# Altium schematic sheet Course.SchDoc
size 594 x 420 mm; Author: ALTIUM GOSTBOM2.0 KEV; SheetNumber: 2; SheetTotal: 2
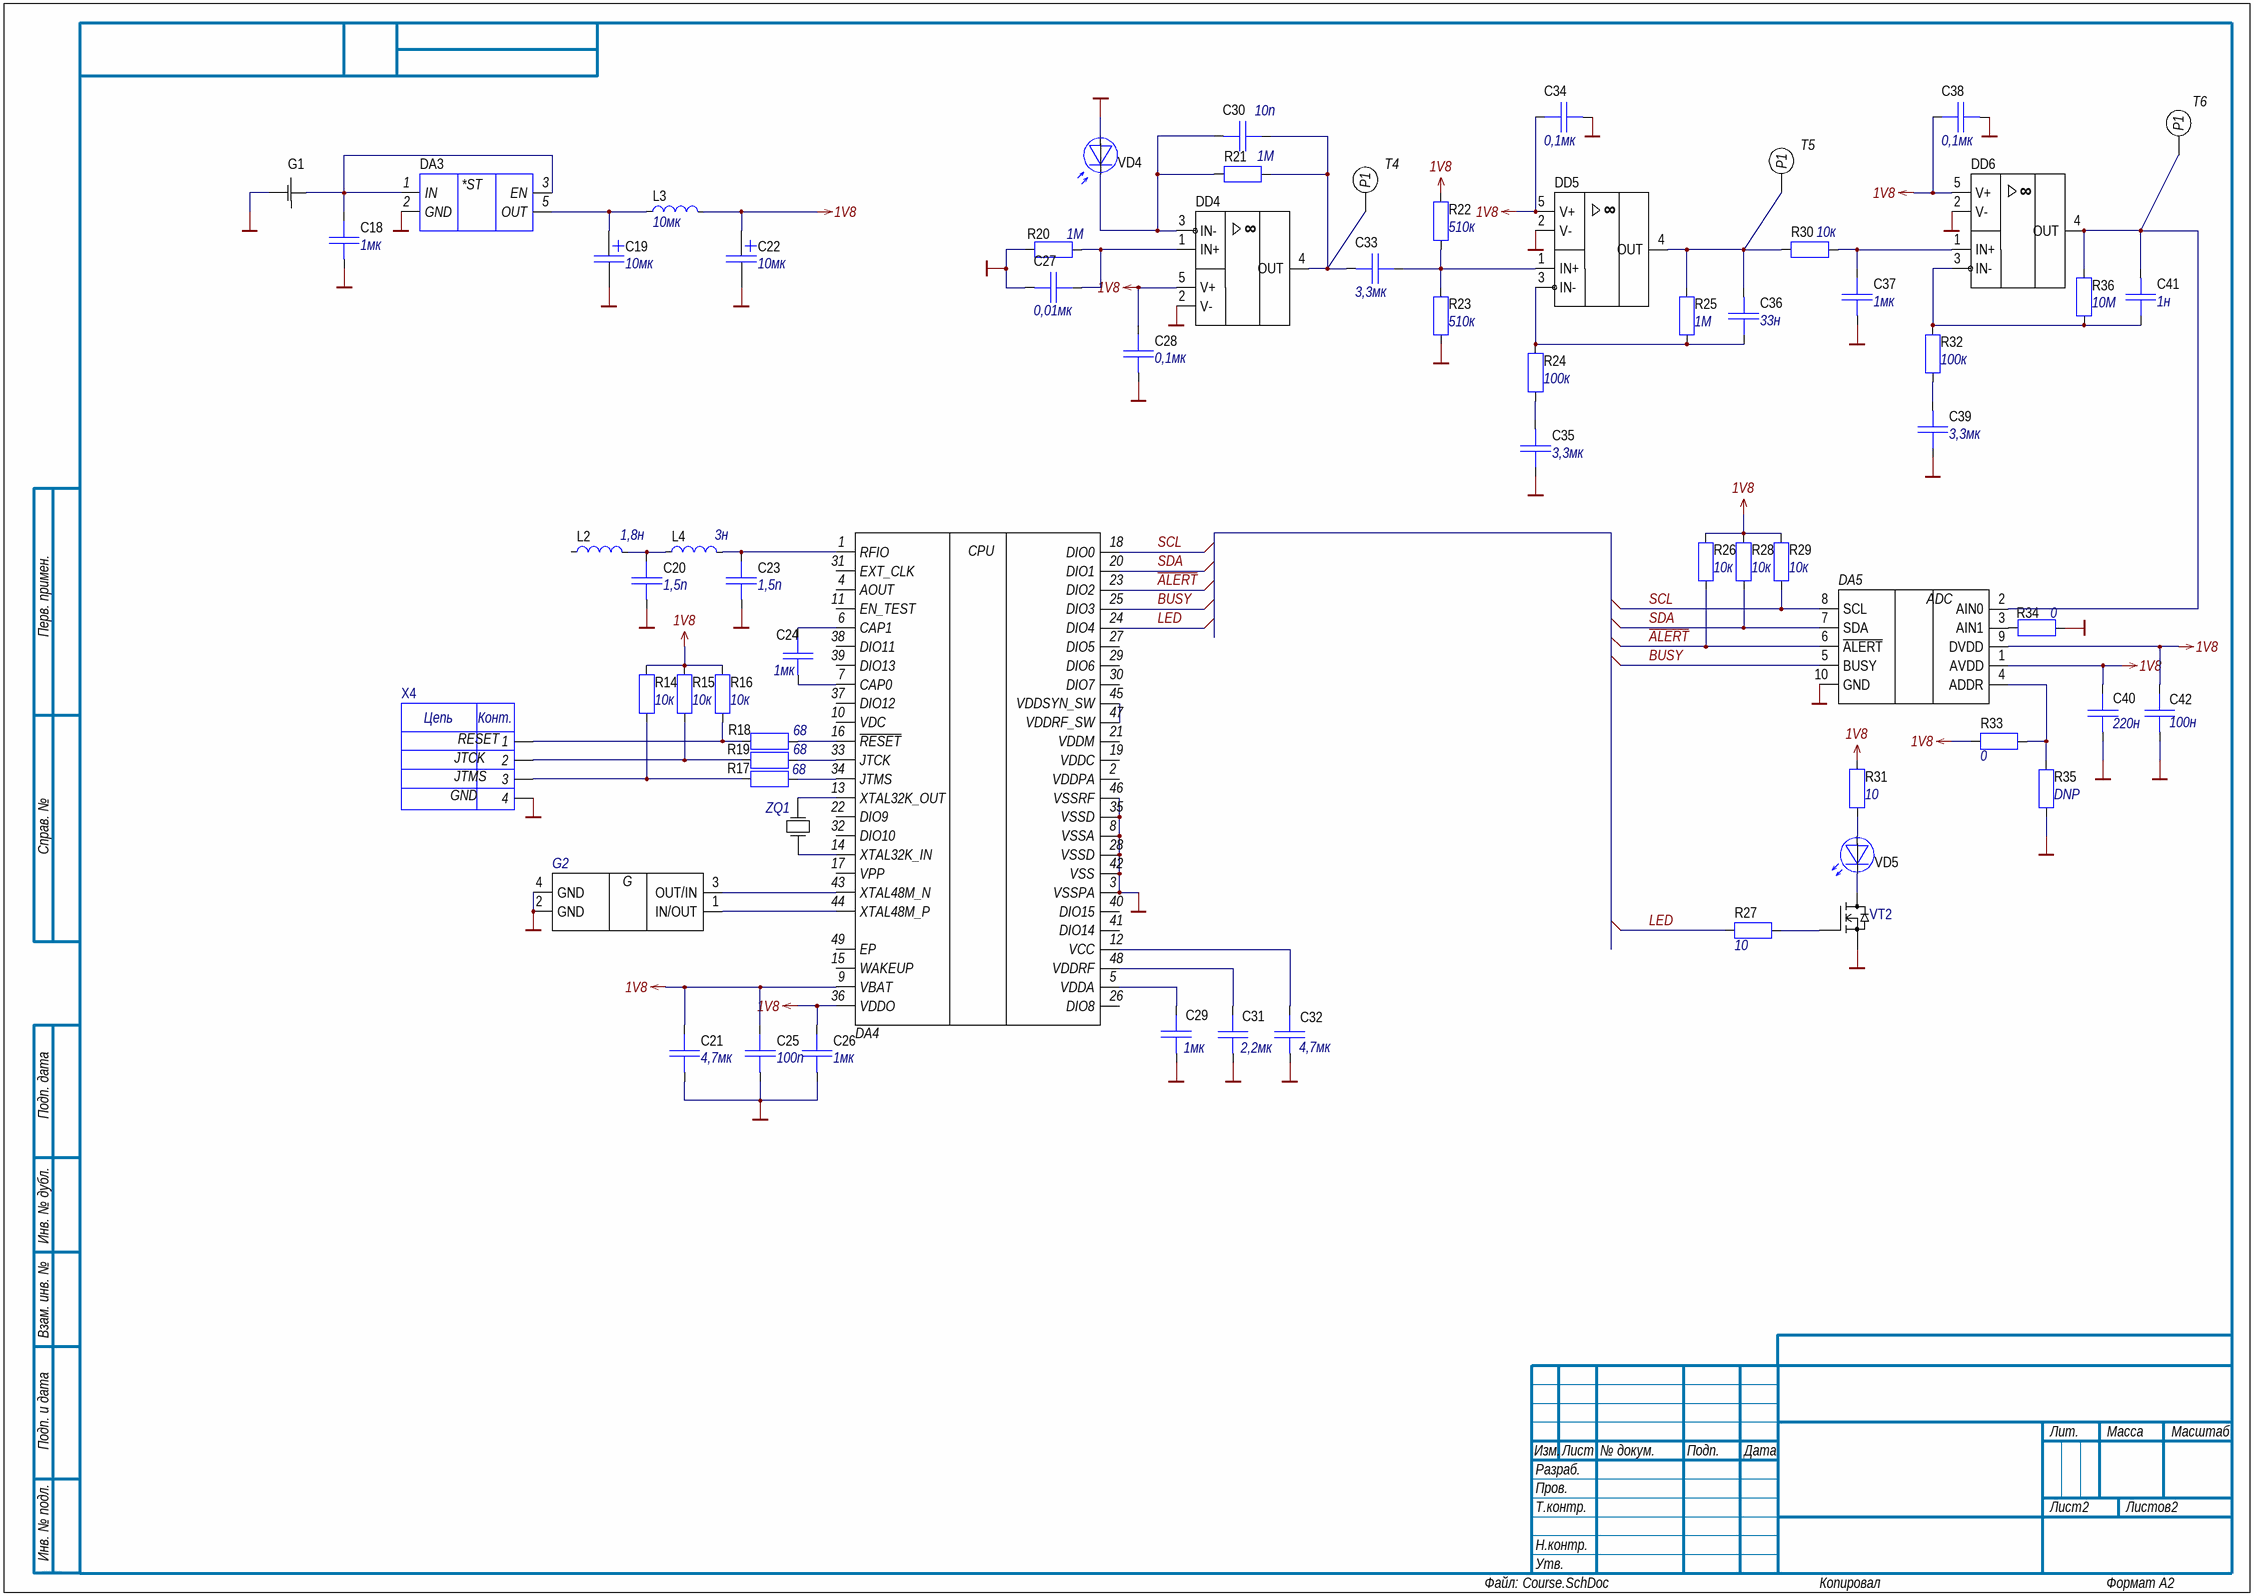
[diagram p0: Course.SchDoc]

## Parts
C18  1мк  [cap0603]
C19  10мк
C20  1,5п  [cap0603]
C21  4,7мк  [CAP0805]
C22  10мк
C23  1,5п  [cap0603]
C24  1мк  [cap0603]
C25  100п  [cap0603]
C26  1мк  [cap0603]
C27  0,01мк  [cap0603]
C28  0,1мк  [cap0603]
C29  1мк  [cap0603]
C30  10п  [cap0603]
C31  2,2мк  [cap0603]
C32  4,7мк  [CAP0805]
C33  3,3мк  [CAP0805]
C34  0,1мк  [cap0603]
C35  3,3мк  [CAP0805]
C36  33н  [cap0603]
C37  1мк  [cap0603]
C38  0,1мк  [cap0603]
C39  3,3мк  [CAP0805]
C40  220н  [cap0603]
C41  1н  [cap0603]
C42  100н  [cap0603]
DA3  (no value)  [TPS7A02]
DA4  RSL10  [RSL10]  (value not drawn)
DA5  ADC  [ADS7142IRUGT]  (value not drawn)
DD4  operational amplifier_2  [OPA333]  (value not drawn)
DD5  operational amplifier_1  [OPA333]  (value not drawn)
DD6  operational amplifier_1  [OPA333]  (value not drawn)
G1  battery  (value not drawn)
G2  Обозначение при заказе  [XTAL48]  (value not drawn)
L2  1,8н  [IND0402]
L3  10мк  [MLZ1608M100WT000]
L4  3н  [IND0402]
R14  10к  [Res0603]
R15  10к  [Res0603]
R16  10к  [Res0603]
R17  68  [Res0603]
R18  68  [Res0603]
R19  68  [Res0603]
R20  1M  [Res0603]
R21  1M  [Res0603]
R22  510к  [Res0603]
R23  510к  [Res0603]
R24  100к  [Res0603]
R25  1М  [Res0603]
R26  10к  [Res0603]
R27  10  [Res0603]
R28  10к  [Res0603]
R29  10к  [Res0603]
R30  10к  [Res0603]
R31  10  [Res0603]
R32  100к  [Res0603]
R33  0  [Res0603]
R34  0  [Res0603]
R35  DNP  [Res0603]  (no BOM)
R36  10М  [Res0603]
T4  TestPoint  [TestPoint]  (value not drawn)
T5  TestPoint  [TestPoint]  (value not drawn)
T6  TestPoint  [TestPoint]  (value not drawn)
VD4  (no value)
VD5  (no value)  [LED1206]
VT2  RU1J002YNTCL  [Mosfet]  (value not drawn)
X4  (no value)  [PSL_4]
ZQ1  Обозначение при заказе  [XTAL32]  (value not drawn)

## Nets
1V8: C21.2 C22.1 C25.2 C26.2 C28.2 C34.2 C38.2 C40.2 C42.2 DA4.9(VBAT) DA4.36(VDDO) DA5.1(AVDD) DA5.9(DVDD) DD4.5(V+) DD5.5(V+) DD6.5(V+) L3.2 R14.1 R15.1 R16.1 R22.2 R26.1 R28.1 R29.1 R31.2 R33.1
GND: C18.1 C19.2 C20.1 C21.1 C22.2 C23.1 C25.1 C26.1 C27.1 C28.1 C29.1 C31.1 C32.1 C34.1 C35.2 C37.1 C38.1 C39.2 C40.1 C42.1 DA3.2(GND) DA4.3(VSSPA) DA4.8(VSSA) DA4.28(VSSD) DA4.35(VSSD) DA4.42(VSS) DA4.46(VSSRF) DA5.10(GND) DD4.2(V-) DD5.2(V-) DD6.2(V-) G1.- G2.2(GND) G2.4(GND) R20.1 R23.1 R34.2 R35.2 VD4.1 VT2.2(S) X4.4
~{ALERT}: DA4.23(DIO2) DA5.6(~{ALERT}) R26.2
BUSY: DA4.25(DIO3) DA5.5(BUSY)
LED: DA4.24(DIO4) R27.2
SCL: DA4.18(DIO0) DA5.8(SCL) R29.2
SDA: DA4.20(DIO1) DA5.7(SDA) R28.2
NetC18_2: C18.2 DA3.1(IN) DA3.3(EN) G1.+
NetC19_1: C19.1 DA3.5(OUT) L3.1
NetC20_2: C20.2 L2.2 L4.1
NetC23_2: C23.2 DA4.1(RFIO) L4.2
NetC24_1: C24.1 DA4.7(CAP0)
NetC24_2: C24.2 DA4.6(CAP1)
NetC27_2: C27.2 DD4.1(IN+) R20.2
NetC29_2: C29.2 DA4.5(VDDA)
NetC30_1: C30.1 DD4.3(IN-) R21.1 VD4.2
NetC30_2: C30.2 C33.1 DD4.4(OUT) R21.2 T4.T(P1)
NetC31_2: C31.2 DA4.48(VDDRF)
NetC32_2: C32.2 DA4.12(VCC)
NetC33_2: C33.2 DD5.1(IN+) R22.1 R23.2
NetC35_1: C35.1 R24.2
NetC36_1: C36.1 DD5.4(OUT) R25.1 R30.2 T5.T(P1)
NetC36_2: C36.2 DD5.3(IN-) R24.1 R25.2
NetC37_2: C37.2 DD6.1(IN+) R30.1
NetC39_1: C39.1 R32.2
NetC41_1: C41.1 DA5.2(AIN0) DD6.4(OUT) R36.1 T6.T(P1)
NetC41_2: C41.2 DD6.3(IN-) R32.1 R36.2
NetDA4_13: DA4.13(XTAL32K_OUT) ZQ1.2
NetDA4_14: DA4.14(XTAL32K_IN) ZQ1.1
NetDA4_16: DA4.16(~{RESET}) R18.1
NetDA4_33: DA4.33(JTCK) R19.1
NetDA4_34: DA4.34(JTMS) R17.1
NetDA4_43: DA4.43(XTAL48M_N) G2.3(OUT/IN)
NetDA4_44: DA4.44(XTAL48M_P) G2.1(IN/OUT)
NetDA4_45: DA4.45(VDDSYN_SW) DA4.47(VDDRF_SW)
NetDA5_3: DA5.3(AIN1) R34.1
NetDA5_4: DA5.4(ADDR) R33.2 R35.1
NetR14_2: R14.2 R17.2 X4.3
NetR15_2: R15.2 R19.2 X4.2
NetR16_2: R16.2 R18.2 X4.1
NetR27_1: R27.1 VT2.1(G)
NetR31_1: R31.1 VD5.A
NetVD5_K: VD5.K VT2.3(D)

Not connected (* = marked no-connect by the designer): DA4 2(VDDPA) 4(AOUT) 10(VDC) 11(EN_TEST) 15(WAKEUP) 17(VPP) 19(VDDC) 21(VDDM) 22(DIO9) 26(DIO8) 27(DIO5) 29(DIO6) 30(DIO7) 31(EXT_CLK) 32(DIO10) 37(DIO12) 38(DIO11) 39(DIO13) 40(DIO15) 41(DIO14) 49(EP); L2 1

## Notes on the sheet
- Перв. примен.
- Справ. №
- Подп. дата
- Инв. № дубл.
- Взам. инв. №
- Подп. и дата
- Изм.
- Разраб.
- Лист
- № докум.
- Подп.
- Дата
- Лит.
- Масса
- Масштаб
- Пров.
- Т.контр.
- Листов
- Инв. № подл.
- Н.контр.
- Утв.
- ALTIUM GOSTBOM2.0 KEV
- Файл:
- Копировал
- Формат А2
- (in symbol LDO) *ST
- (in symbol operational amplifier_1) ∞
- (in symbol operational amplifier_2) ∞
- (in symbol PSL4) Цепь; Конт.; RESET; JTCK; JTMS; GND
- (in symbol RSL10) CPU
- (in symbol XTAL48) G

## Library data of the parts
C18 C24 C26 C29 C37 = CapCer: Керамический конденсатор; manufacture: ОЖО.460.107ТУ; nameSuf: -3; name_main: CC0603KRX7R7BB105; Units: Ф; Name: Керамический конденсатор; Value: 1мк
C19 C22 = CapTan: Танталовый конденсатор; manufacture: АЖЯР.673546.004ТУ; name_main: 293D106X9016B2TE3; Units: Ф; Footpr: "E"; Name: Танталовый конденсатор; Value: 10мк
C20 C23 = CapCer: Керамический конденсатор; manufacture: ОЖО.460.107ТУ; name_main: CL10C1R5CB8NNNC; Units: Ф; Name: Керамический конденсатор; Value: 1,5п
C21 C32 C33 C35 C39 = CapCer: Керамический конденсатор; manufacture: ОЖО.460.107ТУ; name_main: GRM21BR60J335K; Units: Ф; Name: Керамический конденсатор
  C21 C32: Value: 4,7мк
  C33 C35 C39: Value: 3,3мк
C25 = CapCer: Керамический конденсатор; manufacture: ОЖО.460.107ТУ; name_main: GRM1885C1H101J; Units: Ф; Name: Керамический конденсатор; Value: 100п
C27 = CapCer: Керамический конденсатор; manufacture: ОЖО.460.107ТУ; name_main: GRM188R71H103K; Units: Ф; Name: Керамический конденсатор; Value: 0,01мк
C28 C34 C38 = CapCer: Керамический конденсатор; manufacture: ОЖО.460.107ТУ; nameSuf: -3; name_main: CC0603KRX7R7BB104; Units: Ф; Name: Керамический конденсатор; Value: 0,1мк
C30 = CapCer: Керамический конденсатор; manufacture: ОЖО.460.107ТУ; name_main: CL10C100JB8NNNC; Units: Ф; Name: Керамический конденсатор; Value: 10п
C31 = CapCer: Керамический конденсатор; manufacture: ОЖО.460.107ТУ; name_main: GRM188R61A225K; Units: Ф; Name: Керамический конденсатор; Value: 2,2мк
C36 = CapCer: Керамический конденсатор; manufacture: ОЖО.460.107ТУ; nameSuf: -3; name_main: CC0603KRX7R7BB333; Units: Ф; Name: Керамический конденсатор; Value: 33н
C40 = CapCer: Керамический конденсатор; manufacture: ОЖО.460.107ТУ; name_main: CL10B224KA8NNNC; Units: Ф; Name: Керамический конденсатор; Value: 220н
C41 = CapCer: Керамический конденсатор; manufacture: ОЖО.460.107ТУ; name_main: GRM188R61C105K; Units: Ф; Name: Керамический конденсатор; Value: 1н
C42 = CapCer: Керамический конденсатор; manufacture: ОЖО.460.107ТУ; name_main: GRM188R71C104KA01D; Units: Ф; Name: Керамический конденсатор; Value: 100н
DA3 = LDO: name: Микросхема; name_main: TPS7A0218PDBVR
DD4 = operational amplifier_2: Операционный усилитель; name_main: OPA333AIDBVR
DD5 DD6 = operational amplifier_1: Операционный усилитель; name_main: OPA333AIDBVR
G2 = XTAL48: ECS-480-8-47-JTN-TR
L2 = Ind: Катушка индуктивности; Units: Гн; name_main: LQG15HS1N8S02D; Name: Катушка индуктивности; Value: 1,8н
L3 = Ind: Катушка индуктивности; Units: Гн; Name: Катушка индуктивности; name_main: MLZ1608M100WT000; Value: 10мк
L4 = Ind: Катушка индуктивности; Units: Гн; name_main: LQG15HS3N0S02D; Name: Катушка индуктивности; Value: 3н
R14-R16 R26 R28-R30 = Res: Резистор; Manufacturer: АЛЯР.434110.005ТУ; Tolerance: 5%; name_main: RC0603FR-0710KL; Name: Резистор; Value: 10к
R17-R19 = Res: Резистор; name_main: AC0603FR-0768RL; Name: Резистор; Value: 68
R20 R25 = Res: Резистор; Tolerance: 1%; name_main: RC0603FR-071ML; Name: Резистор
  R20: Value: 1M
  R25: Value: 1М
R21 = Res: Резистор; name_main: RC0603FR-071ML; Name: Резистор; Value: 1M
R22 R23 = Res: Резистор; name_main: RC0603FR-07510KL; Name: Резистор; Value: 510к
R24 R32 = Res: Резистор; name_main: RC0603FR-07100KL; Name: Резистор; Value: 100к
R27 R31 = Res: Резистор; Tolerance: 5%; name_main: RC0603JR-0710RL; Name: Резистор; Value: 10
R33 R34 = Res: Резистор; Manufacturer: АЛЯР.434110.005ТУ; Tolerance: 5%; name_main: RC0603FR-070RL; Name: Резистор; Value: 0
R35 = Res: Резистор; Manufacturer: АЛЯР.434110.005ТУ; Tolerance: 5%; name_main: Р1-12-0,1-; Name: Резистор; Value: DNP
R36 = Res: Резистор; name_main: RC0603FR-0710ML; Name: Резистор; Value: 10М
VD4 = Photodiode: Name: Детектор; Name_main: SFH 2703
VD5 = Led: Излучатель; manufacture: аА0.339.189ТУ; Name: Индикатор; Name_main: 15412094A9000
VT2 = RU1J002YNTCL: N-MOSFET DirectFET SQ
X4 = PSL4: manufacture: БСАР.430420.014ТУ; name: Разъемы; name_main: PLS-6
ZQ1 = XTAL32.768: FC-135 32.7680KA-AG0